# Altium schematic sheet SiPMT.SchDoc
size A4; Organization: Altium Limited; Address1: L3, 12a Rodborough Rd; Address2: Frenchs Forest; Address3: NSW; Address4: Australia 2086; DocumentNumber: 19; SheetNumber: 19; SheetTotal: 19
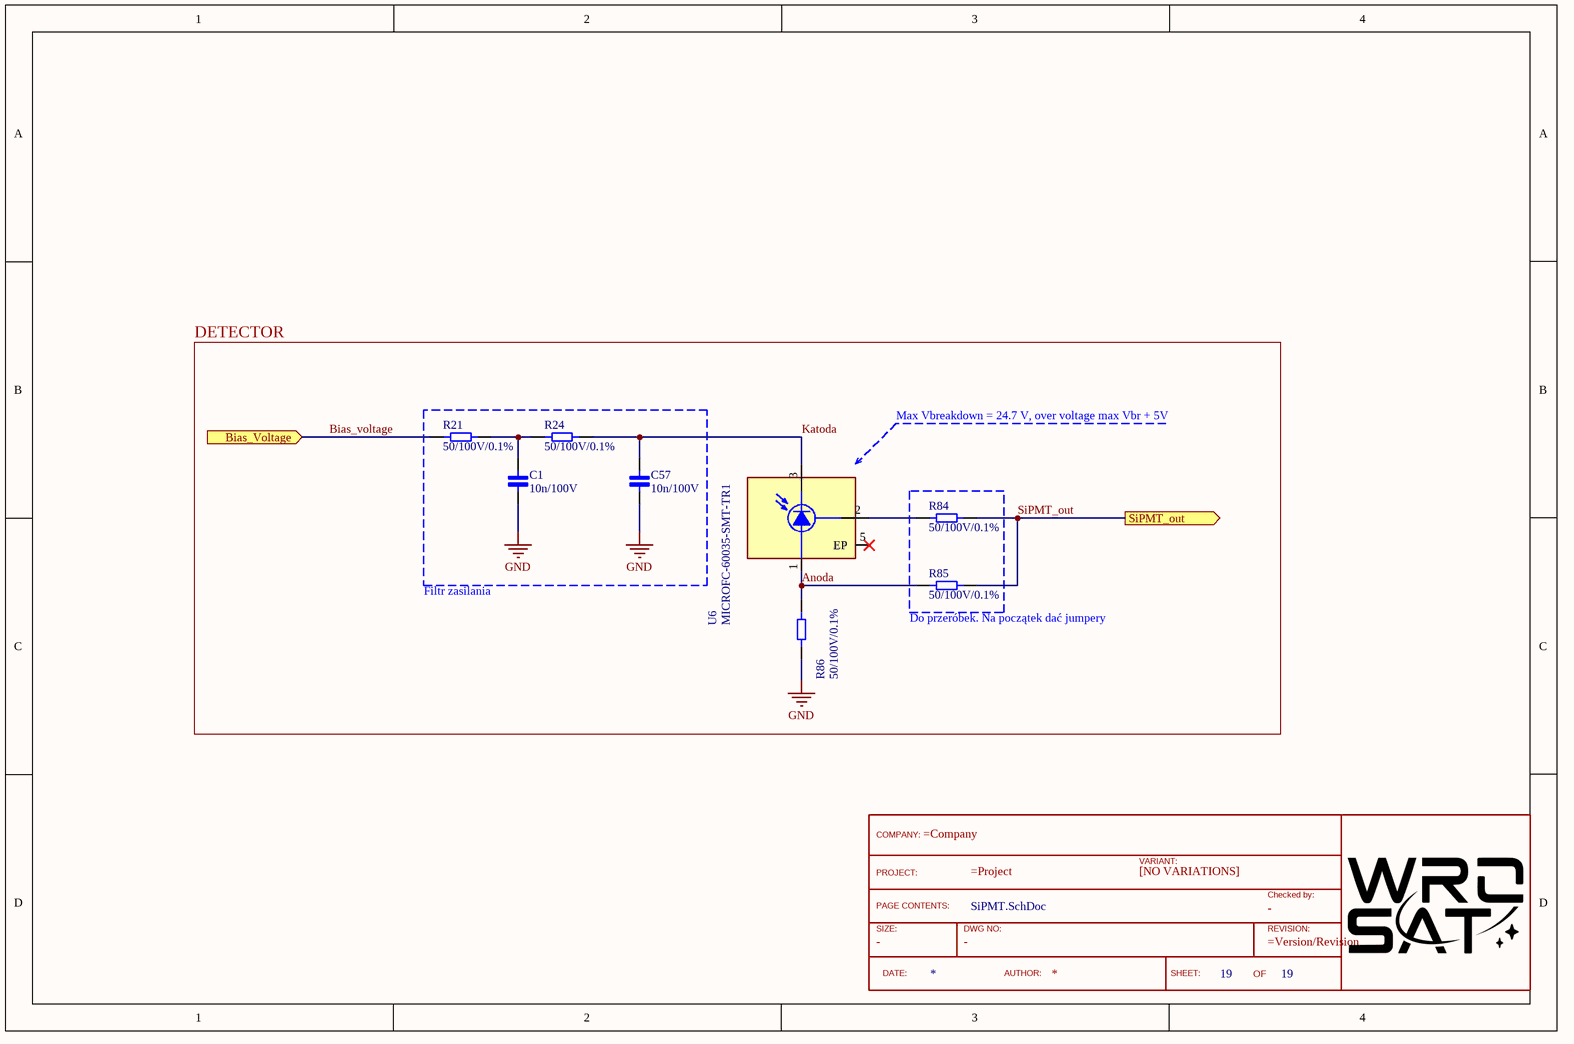
[diagram p0: SiPMT.SchDoc]

## Parts
?  TitleBlock  (value not drawn)  (graphical)
C1  10n/100V  [CAP_0603]
C57  10n/100V  [CAP_0603]
R21  50/100V/0.1%  [RES_0603]
R24  50/100V/0.1%  [RES_0603]
R84  50/100V/0.1%  [RES_0603]
R85  50/100V/0.1%  [RES_0603]
R86  50/100V/0.1%  [RES_0603]
U6  MICROFC-60035-SMT-TR1  [XDCR_MICROFC-60035-SMT-TR1]

## Blocks framed on the sheet
DETECTOR: C1 C57 R21 R24 R84-R86 U6

## Ports
Bias_Voltage (in), SiPMT_out (out)

## Nets
GND: C1.1 C57.1 R86.1
Anoda: R85.2 R86.2 U6.1(P-ANODE)
Bias_voltage: R21.1 ; port Bias_Voltage
Katoda: C57.2 R24.2 U6.3(N-CATHODE)
SiPMT_out: R84.1 R85.1 ; port SiPMT_out
NetC1_2: C1.2 R21.2 R24.1
NetR84_2: R84.2 U6.2(F-FAST_OUTPUT)

Not connected (* = marked no-connect by the designer): U6 5(EP)*

## Notes on the sheet
- Max Vbreakdown = 24.7 V, over voltage max Vbr + 5V
- Filtr zasilania
- (near R85) Do przeróbek. Na początek dać jumpery
- Title
- Size:
- Date:
- A3
- Number:
- Time:
- Revision:
- Sheet
- of
- File:
- (in symbol TitleBlock) COMPANY:; VARIANT:; PROJECT:; [NO VARIATIONS]; Checked by:; PAGE CONTENTS:; SIZE:; DWG NO:; REVISION:; DATE:; AUTHOR:; SHEET:; OF

## Library data of the parts
? = TitleBlock: Standard TitleBlock; DrawingNo: -; Size: -; Checked: -
C1 C57 = Cap_0603_10n_100V: Ceramic Capacitor 10n / 0603 / 100V / ±5%, Wurth Elektronik MLCC; ComponentLink1Description: New link; ComponentLink1URL: https://www.we-online.com/catalog/en/WCAP-CSGP-25VDC
R21 R24 R84-R86 = Res_0603_50: Vishay, thin film resistor 50/100V/0.1%
U6 = MICROFC-60035-SMT-TR1: Photodiode 420nm 1ns 4-SMD, No Lead; MF: ON Semiconductor; Price: None; SnapEDA_Link: https://www.snapeda.com/parts/MICROFC-60035-SMT-TR1/ON%20Semiconductor/view-part/3228590/?ref=snap; Availability: Unavailable; Value: *; MP: MICROFC-60035-SMT-TR1; Package: SMD-4 ON Semiconductor